# Altium schematic sheet Main.SchDoc
size A3
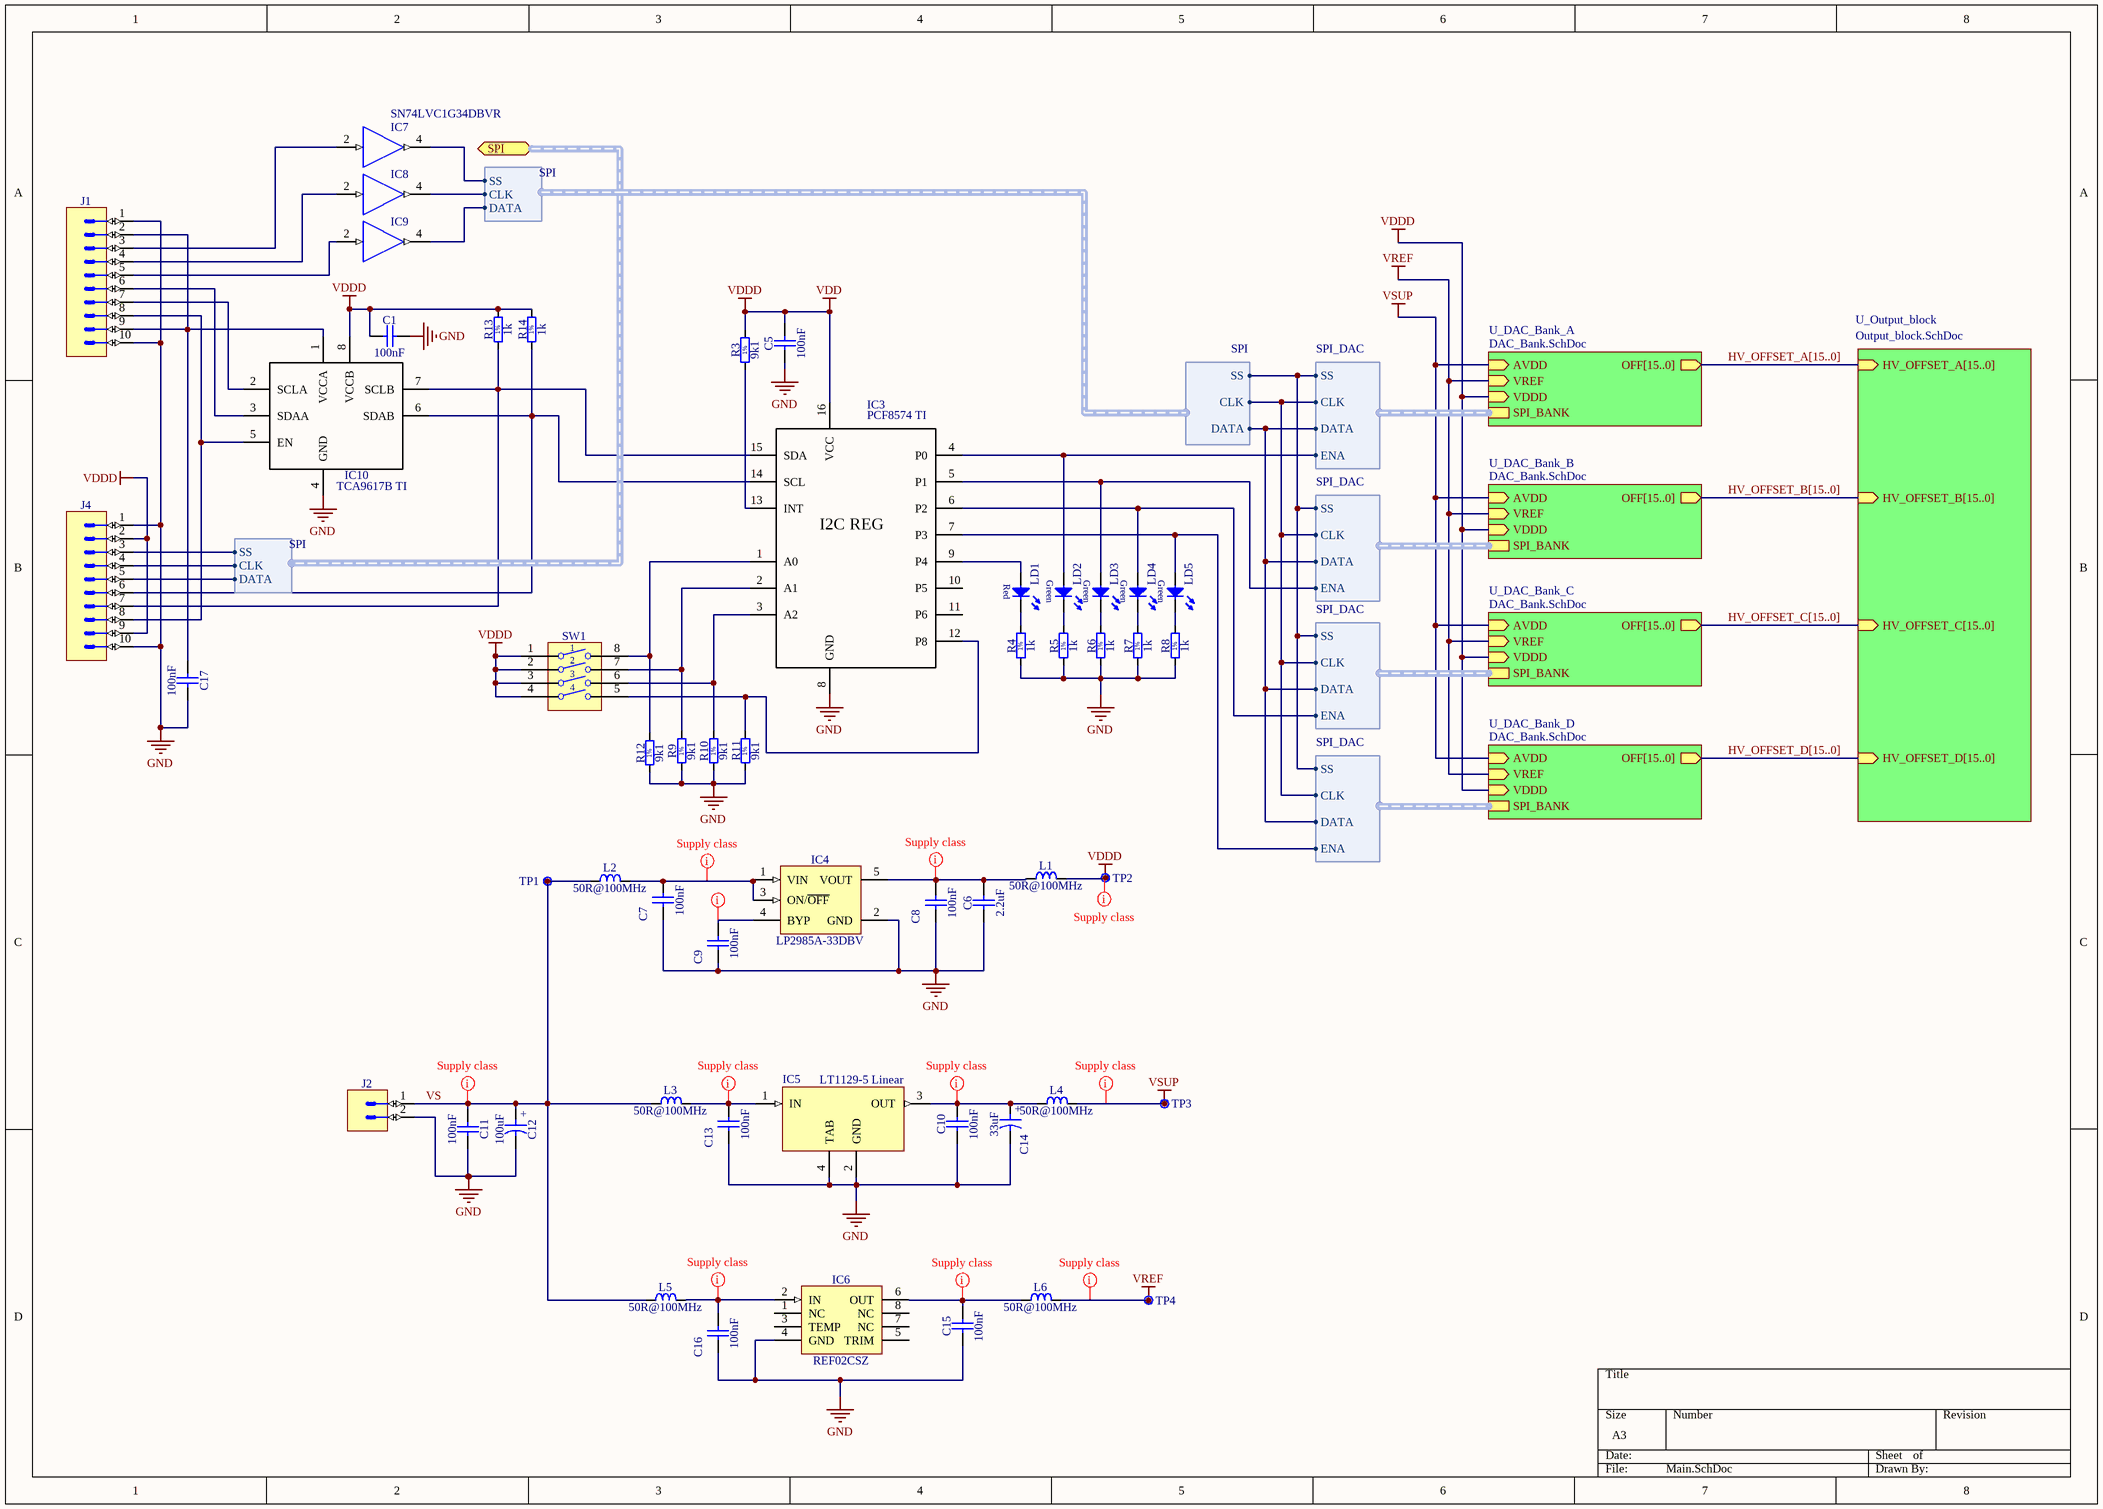
[diagram p0: Main.SchDoc]

## Parts
C1  100nF  [CAPC2012X135N]
C5  100nF  [CAPC2012X135N]
C6  2.2uF  [CAPC2012X135N]
C7  100nF  [CAPC2012X135N]
C8  100nF  [CAPC2012X135N]
C9  100nF  [CAPC2012X135N]
C10  100nF  [CAPC2012X135N]
C11  100nF  [CAPC2012X135N]
C12  100uF  [CAPAE660X540N]
C13  100nF  [CAPC2012X135N]
C14  33uF  [CAPAE660X540N]
C15  100nF  [CAPC2012X135N]
C16  100nF  [CAPC2012X135N]
C17  100nF  [CAPC2012X135N]
IC3  PCF8574 TI  [SOIC127P1030X265-16N]
IC4  LP2985A-33DBV  [SOT95P280X145-5N]
IC5  LT1129-5 Linear  [SOT230P700X175-4N]
IC6  REF02CSZ  [SOIC127P600X175-8N]
IC7  SN74LVC1G34DBVR  [SOT95P280X145-5N]
IC8  SN74LVC1G34DBVR  [SOT95P280X145-5N]  (value not drawn)
IC9  SN74LVC1G34DBVR  [SOT95P280X145-5N]  (value not drawn)
IC10  TCA9617B TI  [TSOP65P490X110-8N]
J1  Header 10  [3M_N2510-5002RB]  (value not drawn)
J2  (no value)  [CAMDEN_CTB9350/2A]
J4  Header 10  [3M_N2510-5002RB]  (value not drawn)
L1  50R@100MHz  [IND_MURATA_BLM31PG]
L2  50R@100MHz  [IND_MURATA_BLM31PG]
L3  50R@100MHz  [IND_MURATA_BLM31PG]
L4  50R@100MHz  [IND_MURATA_BLM31PG]
L5  50R@100MHz  [IND_MURATA_BLM31PG]
L6  50R@100MHz  [IND_MURATA_BLM31PG]
LD1  Super Red  [LED_OSRAM_LSR976]  (value not drawn)
LD2  Green  [LED_OSRAM_LGR971]  (value not drawn)
LD3  Green  [LED_OSRAM_LGR971]  (value not drawn)
LD4  Green  [LED_OSRAM_LGR971]  (value not drawn)
LD5  Green  [LED_OSRAM_LGR971]  (value not drawn)
R3  9k1  [RESC2012X60N]
R4  1k  [RESC2012X60N]
R5  1k  [RESC2012X60N]
R6  1k  [RESC2012X60N]
R7  1k  [RESC2012X60N]
R8  1k  [RESC2012X60N]
R9  9k1  [RESC2012X60N]
R10  9k1  [RESC2012X60N]
R11  9k1  [RESC2012X60N]
R12  9k1  [RESC2012X60N]
R13  1k  [RESC2012X60N]
R14  1k  [RESC2012X60N]
SW1  Switch  [SW_OMRON_A6S-4102-H]  (value not drawn)
TP1  Test Point  [VERO_20-2136]  (value not drawn)
TP2  Test Point  [VERO_20-2136]  (value not drawn)
TP3  Test Point  [VERO_20-2136]  (value not drawn)
TP4  Test Point  [VERO_20-2136]  (value not drawn)

## Sub-sheets
U_DAC_Bank_A = DAC_Bank.SchDoc: AVDD (in), VREF (in), VDDD (in), SPI_BANK (harness SPI_DAC), OFF[15..0] (out)
U_DAC_Bank_B = DAC_Bank.SchDoc: AVDD (in), VREF (in), VDDD (in), SPI_BANK (harness SPI_DAC), OFF[15..0] (out)
U_DAC_Bank_C = DAC_Bank.SchDoc: AVDD (in), VREF (in), VDDD (in), SPI_BANK (harness SPI_DAC), OFF[15..0] (out)
U_DAC_Bank_D = DAC_Bank.SchDoc: AVDD (in), VREF (in), VDDD (in), SPI_BANK (harness SPI_DAC), OFF[15..0] (out)
U_Output_block = Output_block.SchDoc: HV_OFFSET_A[15..0] (in), HV_OFFSET_D[15..0] (in), HV_OFFSET_C[15..0] (in), HV_OFFSET_B[15..0] (in)

## Ports
SPI (bidir, harness SPI)

## Harnesses
SPI_DAC: DATA, CLK, SS, ENA
SPI: DATA, CLK, SS

## Nets
GND: C1.2 C5.1 C6.1 C7.1 C8.1 C9.1 C10.1 C11.2 C12.2 C13.1 C14.2 C15.1 C16.1 C17.2 IC3.8(GND) IC4.2(GND) IC5.2(GND) IC5.4(TAB) IC6.4(GND) IC7.3(GND) IC8.3(GND) IC9.3(GND) IC10.4(GND) J1.1 J1.10 J2.2 J4.1 J4.10 R4.1 R5.1 R6.1 R7.1 R8.1 R9.1 R10.1 R11.1 R12.1
VDD: C1.1 C5.2 IC3.16(VCC) IC7.5(VCC) IC8.5(VCC) IC9.5(VCC) IC10.8(VCCB) J4.2 J4.9 L1.2 R3.2 R13.2 R14.2 SW1.1 SW1.2 SW1.3 SW1.4 TP2.1 ; sheet U_DAC_Bank_A/VDDD, sheet U_DAC_Bank_B/VDDD, sheet U_DAC_Bank_C/VDDD, sheet U_DAC_Bank_D/VDDD  [also labelled VDDD]
VREF: L6.2 TP4.1 ; sheet U_DAC_Bank_A/VREF, sheet U_DAC_Bank_B/VREF, sheet U_DAC_Bank_C/VREF, sheet U_DAC_Bank_D/VREF
VSUP: L4.2 TP3.1 ; sheet U_DAC_Bank_A/AVDD, sheet U_DAC_Bank_B/AVDD, sheet U_DAC_Bank_C/AVDD, sheet U_DAC_Bank_D/AVDD
VS: C11.1 C12.1 J2.1 L2.1 L3.1 L5.1 TP1.1
NetC6_2: C6.2 C8.2 IC4.5(VOUT) L1.1
NetC7_2: C7.2 IC4.1(VIN) IC4.3(ON/~{OFF}) L2.2
NetC9_2: C9.2 IC4.4(BYP)
NetC10_2: C10.2 C14.1 IC5.3(OUT) L4.1
NetC13_2: C13.2 IC5.1(IN) L3.2
NetC15_2: C15.2 IC6.6(OUT) L6.1
NetC16_2: C16.2 IC6.2(IN) L5.2
NetC17_1: C17.1 IC10.1(VCCA) J1.2 J1.9
NetIC3_1: IC3.1(A0) R12.2 SW1.8
NetIC3_2: IC3.2(A1) R9.2 SW1.7
NetIC3_3: IC3.3(A2) R10.2 SW1.6
NetIC3_4: IC3.4(P0) LD2.2(A) ; sheet U_DAC_Bank_A/SPI_BANK.ENA
NetIC3_5: IC3.5(P1) LD3.2(A) ; sheet U_DAC_Bank_B/SPI_BANK.ENA
NetIC3_6: IC3.6(P2) LD4.2(A) ; sheet U_DAC_Bank_C/SPI_BANK.ENA
NetIC3_7: IC3.7(P3) LD5.2(A) ; sheet U_DAC_Bank_D/SPI_BANK.ENA
NetIC3_9: IC3.9(P4) LD1.2(A)
NetIC3_12: IC3.12(P8) R11.2 SW1.5
NetIC3_13: IC3.13(INT) R3.1
NetIC3_14: IC3.14(SCL) IC10.6(SDAB) J4.6 R14.1
NetIC3_15: IC3.15(SDA) IC10.7(SCLB) J4.7 R13.1
NetIC7_2: IC7.2(IN) J1.3
NetIC7_4: IC7.4(OUT) J4.3 ; sheet U_DAC_Bank_A/SPI_BANK.SS, port SPI.SS, sheet U_DAC_Bank_B/SPI_BANK.SS, sheet U_DAC_Bank_C/SPI_BANK.SS, sheet U_DAC_Bank_D/SPI_BANK.SS
NetIC8_2: IC8.2(IN) J1.4
NetIC8_4: IC8.4(OUT) J4.4 ; sheet U_DAC_Bank_A/SPI_BANK.CLK, port SPI.CLK, sheet U_DAC_Bank_B/SPI_BANK.CLK, sheet U_DAC_Bank_C/SPI_BANK.CLK, sheet U_DAC_Bank_D/SPI_BANK.CLK
NetIC9_2: IC9.2(IN) J1.5
NetIC9_4: IC9.4(OUT) J4.5 ; sheet U_DAC_Bank_A/SPI_BANK.DATA, port SPI.DATA, sheet U_DAC_Bank_B/SPI_BANK.DATA, sheet U_DAC_Bank_C/SPI_BANK.DATA, sheet U_DAC_Bank_D/SPI_BANK.DATA
NetIC10_2: IC10.2(SCLA) J1.7
NetIC10_3: IC10.3(SDAA) J1.6
NetIC10_5: IC10.5(EN) J1.8 J4.8
NetLD1_1: LD1.1(C) R4.2
NetLD2_1: LD2.1(C) R5.2
NetLD3_1: LD3.1(C) R6.2
NetLD4_1: LD4.1(C) R7.2
NetLD5_1: LD5.1(C) R8.2

Not connected (* = marked no-connect by the designer): IC3 10(P5) 11(P6); IC6 1(NC) 3(TEMP) 5(TRIM) 7(NC) 8(NC)

## Buses and harness runs
bus HV_OFFSET_A[15..0] = sheet U_DAC_Bank_A/OFF[15..0] = sheet U_Output_block/HV_OFFSET_A[15..0]
bus HV_OFFSET_B[15..0] = sheet U_DAC_Bank_B/OFF[15..0] = sheet U_Output_block/HV_OFFSET_B[15..0]
bus HV_OFFSET_C[15..0] = sheet U_DAC_Bank_C/OFF[15..0] = sheet U_Output_block/HV_OFFSET_C[15..0]
bus HV_OFFSET_D[15..0] = sheet U_DAC_Bank_D/OFF[15..0] = sheet U_Output_block/HV_OFFSET_D[15..0]

## Layout directives
net class Supply: NetC6_2, NetC7_2, NetC9_2, NetC10_2, NetC13_2, NetC15_2, NetC16_2, VDD, VREF, VS, VSUP

## Notes on the sheet
- (in symbol CAE660-540_33UF_25V_20%) +
- (in symbol CAE660-540_100UF_16V_20%) +
- (in symbol LED_OSRAM_LSR976) Red
- (in symbol PCF8574) I2C REG
- (in symbol R0805_1K_1%_0.125W_100PPM) 1%
- (in symbol R0805_9K1_1%_0.125W_100PPM) 1%

## Library data of the parts
C1 C5 C7-C11 C13 C15-C17 = CC0805_100NF_50V_10%_X7R: Non-polarised capacitor; Part Description: SMD Multilayer Chip Ceramic Capacitor; Manufacturer: GENERIC; Manufacturer1 Part Number: C2012X7R1H104K085AA; Voltage: 50V; TC: X7R; Tolerance: ±10%; Part Number: CC0805_100NF_50V_10%_X7R; Component Kind: Standard; Component Type: Standard; Pin Count: 2; Value: 100nF; Status: Preferred; Manufacturer Part Number: CC0805_100NF_50V_10%_X7R; Case: 0805; Mounted: Yes; Socket: No; SMD: Yes; Sense: No; Manufacturer1 Example: TDK; Manufacturer1 ComponentHeight: 1mm; HelpURL: \\cern.ch\dfs\Applications\Altium\Datasheets\CC0805_X7R_TDK_C.pdf; Author: CERN DEM JLC; CreateDate: 03.12.2007; LatestRevisionDate: 22.04.2015
C6 = CC0805_2.2UF_16V_10%_X7R: Non-polarised capacitor; Part Description: SMD Multilayer Chip Ceramic Capacitor; Manufacturer: GENERIC; Manufacturer1 Part Number: GRM21BF51C225ZA01L; Voltage: 16V; TC: X7R; Tolerance: ±10%; Part Number: CC0805_2.2UF_16V_10%_X7R; Component Kind: Standard; Component Type: Standard; Pin Count: 2; Value: 2.2uF; Status: Preferred; Manufacturer Part Number: CC0805_2.2UF_16V_10%_X7R; Case: 0805; Mounted: Yes; Socket: No; SMD: Yes; Sense: No; Manufacturer1 Example: MURATA; Manufacturer1 ComponentHeight: 1.5mm; HelpURL: \\cern.ch\dfs\Applications\Altium\Datasheets\CC0805_X7R_MURATA_GRM.pdf; Author: CERN DEM JLC; CreateDate: 03.12.2007; LatestRevisionDate: 18.09.2014
C12 = CAE660-540_100UF_16V_20%: Polarised capacitor; Part Description: Aluminum Electrolytic SMT Capacitor; Manufacturer: PANASONIC; Manufacturer Part Number: EEEFK1C101AP; Voltage: 16V; Tolerance: ±20%; Part Number: CAE660-540_100UF_16V_20%; Component Kind: Standard; Component Type: Standard; Pin Count: 2; Value: 100uF; Status: Not Recommended; Case: D; Mounted: Yes; Socket: No; SMD: Yes; Sense: No; ComponentHeight: 5.8mm; HelpURL: \\cern.ch\dfs\Applications\Altium\Datasheets\CAE_PANASONIC_FK.pdf; Author: CERN DEM JLC; CreateDate: 03.12.2007; LatestRevisionDate: 05.11.2014
C14 = CAE660-540_33UF_25V_20%: Polarised capacitor; Part Description: Aluminum Electrolytic SMT Capacitor; Manufacturer: PANASONIC; Manufacturer Part Number: EEEFK1E330AP; Voltage: 25V; Tolerance: ±20%; Part Number: CAE660-540_33UF_25V_20%; Component Kind: Standard; Component Type: Standard; Pin Count: 2; Value: 33uF; Status: Not Recommended; Case: D; Mounted: Yes; Socket: No; SMD: Yes; Sense: No; ComponentHeight: 5.8mm; HelpURL: \\cern.ch\dfs\Applications\Altium\Datasheets\CAE_PANASONIC_FK.pdf; Author: CERN DEM JLC; CreateDate: 03.12.2007; LatestRevisionDate: 05.11.2014
IC3 = PCF8574: Name: PCF8574; Manufacturer: TI
IC4 = LP2985A-33DBV: 150mA Low-Noise Low-Dropout Regulator Whit Shutdown; Part Description: 3.3V, 150mA Low-Noise Low-Dropout Regulator Whit Shutdown; Manufacturer: TEXAS INSTRUMENTS; PressFit: No; Bonding: No; Part Number: LP2985A-33DBV; Component Kind: Standard; Component Type: Standard; Device: LP2985A-33DBV; PackageDescription: SOT, 0.95mm pitch; 5 pin, 1.60mm W X 2.90mm L X 1.45mm H body, IPC Medium Density; Manufacturer Part Number: LP2985A-33DBV; Pin Count: 5; Case: SOT23-5; Mounted: Yes; Socket: No; SMD: Yes; Sense: No; ComponentHeight: 1.45mm; HelpURL: \\cern.ch\dfs\Applications\Altium\Datasheets\LP2985A-33DBV.pdf; Author: CERN DEM JLC; CreateDate: 17.03.2011; LatestRevisionDate: 17.03.2011
IC5 = LT1129-5: Name: LT1129-5; Manufacturer: Linear
IC6 = REF02CSZ: Precision Voltage Reference/Temperature Transducer; Part Description: 5V Precision Voltage Reference/Temperature Transducer; Manufacturer: ANALOG DEVICES; PressFit: No; Bonding: No; Part Number: REF02CSZ; Component Kind: Standard; Component Type: Standard; Device: REF02CSZ; PackageDescription: SOIC 8, Pitch 1.27mm, Body 4x5mm, IPC Medium Density; Manufacturer Part Number: REF02CSZ; Pin Count: 8; Case: SOIC8; Mounted: Yes; Socket: No; SMD: Yes; Sense: No; ComponentHeight: 1.75mm; HelpURL: \\cern.ch\dfs\Applications\Altium\Datasheets\REF02CSZ.pdf; Author: CERN DEM JLC; CreateDate: 29.05.2008; LatestRevisionDate: 29.05.2008
IC7-IC9 = SN74LVC1G34DBVR: Single Buffer Gate; Manufacturer: TEXAS INSTRUMENTS; PressFit: No; Bonding: No; Part Number: SN74LVC1G34DBVR; Component Kind: Standard; Component Type: Standard; Device: SN74LVC1G34DBVR; PackageDescription: SOT, 0.95mm pitch; 5 pin, 1.60mm W X 2.90mm L X 1.45mm H body, IPC Medium Density; Part Description: Single Buffer Gate; Manufacturer Part Number: SN74LVC1G34DBVR; Pin Count: 5; Case: SOT23-5; Mounted: Yes; Socket: No; SMD: Yes; Sense: No; ComponentHeight: 1.45mm; Author: CERN DEM JLC; HelpURL: \\cern.ch\dfs\Applications\Altium\Datasheets\SN74LVC1G34DBVR.pdf; CreateDate: 20.01.2014; LatestRevisionDate: 20.01.2014
IC10 = TCA9617B: Name: TCA9617B; Manufacturer: TI
J1 J4 = 3M_N2510-5002RB: Connector 10 Male; Part Description: 10 Contacts - Right Angle .100" x .100" Low Profile Four-Wall Header, 2500 Series; Manufacturer: 3M; PressFit: No; Part Number: 3M_N2510-5002RB; Component Kind: Standard; Component Type: Standard; Pin Count: 10; Family: Header 10; Mounted: Yes; Socket: No; SMD: No; Sense: No; Status: None; Manufacturer Part Number: N2510-5002RB; ComponentHeight: 8.59mm; HelpURL: \\cern.ch\dfs\Applications\Altium\Datasheets\3M_N2510-5002RB.pdf; Author: CERN DEM JLC; CreateDate: 29.10.2008; LatestRevisionDate: 11.08.2009
J2 = CAMDEN_CTB9350/2A: Connector 2 Male; Part Description: 12A 380V, Pitch: 5mm, 2 Positions, Horizontal  Male Terminal Block; Manufacturer: CAMDEN; PressFit: No; Part Number: CAMDEN_CTB9350/2A; Component Kind: Standard; Component Type: Standard; Pin Count: 2; Mounted: Yes; Socket: No; SMD: No; Sense: No; Status: None; Manufacturer Part Number: CTB9350/2A; ComponentHeight: 8.3mm; HelpURL: \\cern.ch\dfs\Applications\Altium\Datasheets\CAMDEN_CTB9350-2A.pdf; Author: CERN DEM JLC; CreateDate: 28.09.2011; LatestRevisionDate: 28.09.2011
L1-L6 = IND1206_MURATA_BLM31PG500SN1: Inductor; Part Description: SMD EMIFIL Chip Ferrite Bead; Manufacturer: MURATA; Power: 3.5A; Resistance: 0.015R; Part Number: IND1206_MURATA_BLM31PG500SN1; Component Kind: Standard; Component Type: Standard; Pin Count: 2; Value: 50R@100MHz; Status: None; Manufacturer Part Number: BLM31PG500SN1; Case: 1206; Mounted: Yes; Socket: No; SMD: Yes; Sense: No; ComponentHeight: 1.3mm; HelpURL: \\cern.ch\dfs\Applications\Altium\Datasheets\IND1206_MURATA_BLM31P.pdf; Author: CERN DEM JLC; CreateDate: 05.12.2013; LatestRevisionDate: 05.12.2013
LD1 = LED_OSRAM_LSR976: LED Red 1C 2A; Part Description: Surface Mount Super Red LED (0805 Case); Manufacturer: OSRAM; Manufacturer Part Number: LSR976; PressFit: No; Bonding: No; Part Number: LED_OSRAM_LSR976; Component Kind: Standard; Component Type: Standard; Color: Super Red; PackageDescription: Super Red Chip LED, 2-Leads, Body 2 x1.25mm, IPC Medium Density; Pin Count: 2; Case: 0805; Mounted: Yes; Socket: No; SMD: Yes; Sense: No; ComponentHeight: 0.9mm; HelpURL: \\cern.ch\dfs\Applications\Altium\Datasheets\LED_OSRAM_LSR976.pdf; Author: CERN DEM JLC; CreateDate: 18.05.2010; LatestRevisionDate: 18.05.2010
LD2-LD5 = LED_OSRAM_LGR971: LED Green 1C 2A; Part Description: Surface Mount Green LED (0805 Case); Manufacturer: OSRAM; Manufacturer Part Number: LGR971; PressFit: No; Bonding: No; Part Number: LED_OSRAM_LGR971; Component Kind: Standard; Component Type: Standard; Color: Green; PackageDescription: Green Chip LED, 2-Leads, Body 2.0x1.25mm, IPC Medium Density; Pin Count: 2; Case: 0805; Mounted: Yes; Socket: No; SMD: Yes; Sense: No; ComponentHeight: 0.9mm; HelpURL: \\cern.ch\dfs\Applications\Altium\Datasheets\LED_OSRAM_LGR971.pdf; Author: CERN DEM JLC; CreateDate: 28.01.2009; LatestRevisionDate: 17.03.2010
R3 R9-R12 = R0805_9K1_1%_0.125W_100PPM: Resistor - 1%; Part Description: General Purpose Thick Film Chip Resistor; Manufacturer: GENERIC; Manufacturer1 Part Number: NRC10F9101TRF; Power: 0.125W; TC: ±100ppm/°C; PressFit: No; Part Number: R0805_9K1_1%_0.125W_100PPM; Component Kind: Standard; Component Type: Standard; Pin Count: 2; Value: 9k1; Status: Preferred; Tolerance: ±1%; Manufacturer Part Number: R0805_9K1_1%_0.125W_100PPM; Case: 0805; Mounted: Yes; Sense: No; Socket: No; SMD: Yes; Manufacturer1 Example: NIC COMPONENT; Manufacturer1 ComponentHeight: 0.6mm; HelpURL: \\cern.ch\dfs\Applications\Altium\Datasheets\R0805_NIC_NRC.pdf; Author: CERN DEM JLC; CreateDate: 03.12.2007; LatestRevisionDate: 13.03.2008
R4-R8 R13 R14 = R0805_1K_1%_0.125W_100PPM: Resistor - 1%; Part Description: General Purpose Thick Film Chip Resistor; Manufacturer: GENERIC; Manufacturer1 Part Number: NRC10F1001TRF; Power: 0.125W; TC: ±100ppm/°C; PressFit: No; Part Number: R0805_1K_1%_0.125W_100PPM; Component Kind: Standard; Component Type: Standard; Pin Count: 2; Value: 1k; Status: Preferred; Tolerance: ±1%; Manufacturer Part Number: R0805_1K_1%_0.125W_100PPM; Case: 0805; Mounted: Yes; Sense: No; Socket: No; SMD: Yes; Manufacturer1 Example: NIC COMPONENT; Manufacturer1 ComponentHeight: 0.6mm; HelpURL: \\cern.ch\dfs\Applications\Altium\Datasheets\R0805_NIC_NRC.pdf; Author: CERN DEM JLC; CreateDate: 03.12.2007; LatestRevisionDate: 13.03.2008
SW1 = SW_OMRON_A6S-4102-H: 4 Ways SPST DIP Switch; Part Description: 4 Ways SPST DIP Switch, White Flat Actuator with Seal Tape, Contact Rating 25mA 24VDC; Manufacturer: OMRON; PressFit: No; Part Number: SW_OMRON_A6S-4102-H; Component Kind: Standard; Component Type: Standard; Pin Count: 8; PackageDescription: Pitch 2.54mm, Body 11.3x6.4mm, 4 Ways SPST Surface-Mounting DIP Switch, OMRON A6S-H; Family: Switch; Mounted: Yes; Socket: No; SMD: Yes; Sense: No; Status: None; Manufacturer Part Number: A6S-4102-H; ComponentHeight: 3.8mm; HelpURL: \\cern.ch\dfs\Applications\Altium\Datasheets\SW_OMRON_A6S-4102-H.pdf; Author: CERN DEM JMW; CreateDate: 25.09.2008; LatestRevisionDate: 25.09.2008
TP1-TP4 = VERO_20-2136: Part Description: Black Bead PCB Terminal Test Pin for 1.6mm PCB Thickness (1.32mm Hole); Manufacturer: VERO TECHNOLOGIES; PressFit: No; Part Number: VERO_20-2136; Component Kind: Standard; Component Type: Standard; Pin Count: 1; Family: Test Point; Mounted: Yes; Socket: No; SMD: No; Sense: No; Status: None; Manufacturer Part Number: 20-2136; ComponentHeight: 5.3mm; HelpURL: \\cern.ch\dfs\Applications\Altium\Datasheets\VERO_20-2136.pdf; Author: CERN DEM JLC; CreateDate: 21.07.2008; LatestRevisionDate: 15.07.2013